# EAGLE design piezo (EAGLE 9.2.2)
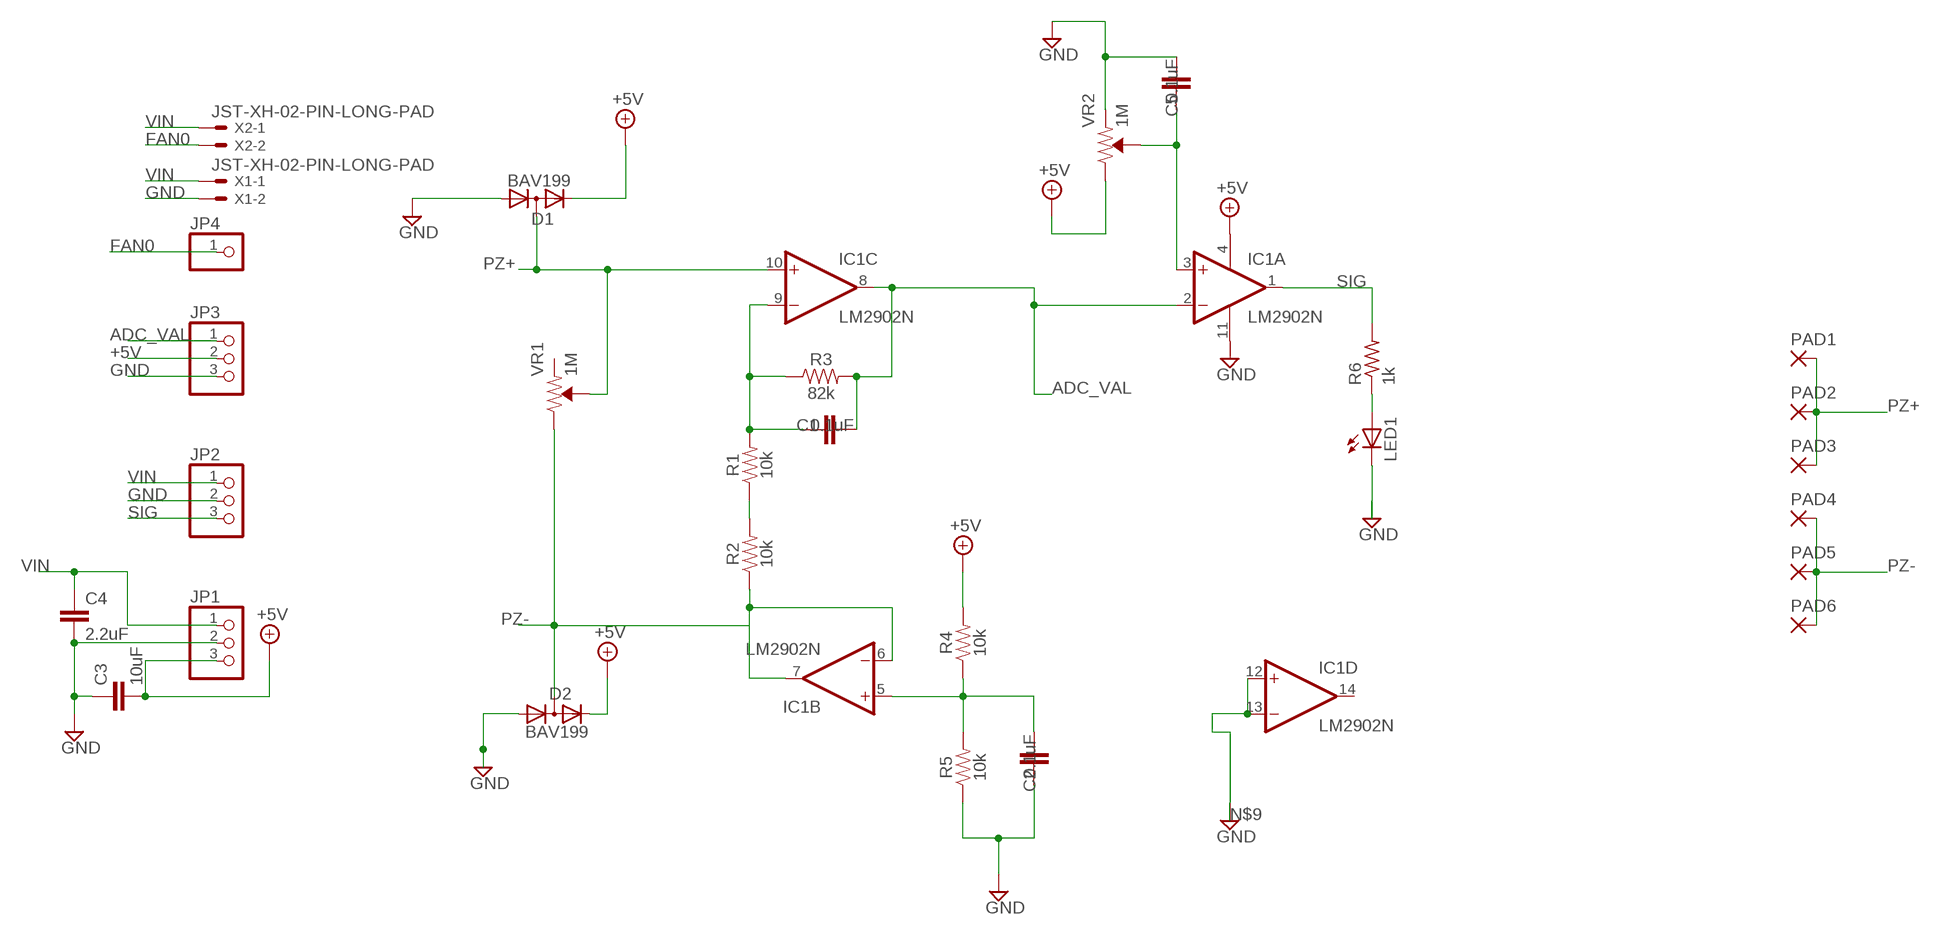
[diagram p0: schematic, sheet 1]

## Parts
C1  0.1uF  C-EU025-024X044  [C025-024X044]
C2  0.1uF  C-EU025-024X044  [C025-024X044]
C3  10uF  C2,5-3  [C2.5-3]
C4  2.2uF  C2,5-3  [C2.5-3]
C5  0.1uF  C-EU025-024X044  [C025-024X044]
D1  BAV199  [SOT23]
D2  BAV199  [SOT23]
IC1  LM2902N  [DIL14]
JP1  PINHD-1X3  [1X03]
JP2  PINHD-1X3  [1X03]
JP3  PINHD-1X3  [1X03]
JP4  PINHD-1X1  [1X01]
LED1  LED5MM  [LED5MM]
PAD1  1,6/0,8  [1,6/0,8]
PAD2  1,6/0,8  [1,6/0,8]
PAD3  1,6/0,8  [1,6/0,8]
PAD4  1,6/0,8  [1,6/0,8]
PAD5  1,6/0,8  [1,6/0,8]
PAD6  1,6/0,8  [1,6/0,8]
R1  10k  10KOHM-HORIZ-1/4W-1%  [AXIAL-0.3]
R2  10k  10KOHM-HORIZ-1/4W-1%  [AXIAL-0.3]
R3  82k  100KOHM-HORIZ-1/4W-1%  [AXIAL-0.3]
R4  10k  10KOHM-HORIZ-1/4W-1%  [AXIAL-0.3]
R5  10k  10KOHM-HORIZ-1/4W-1%  [AXIAL-0.3]
R6  1k  R-US_0207/9  [0207/9]
VR1  1M  TRIMPOT-SMD-3MM-OPEN-1/10W-25%  [TRIMPOT-SMD-TC33X]
VR2  1M  TRIMPOT-SMD-3MM-OPEN-1/10W-25%  [TRIMPOT-SMD-TC33X]
X1  JST-XH-02-PIN-LONG-PAD  [JST-XH-02-PACKAGE-LONG-PAD]
X2  JST-XH-02-PIN-LONG-PAD  [JST-XH-02-PACKAGE-LONG-PAD]

## Nets
+5V: C3.2 D1.2(C) D2.2(C) IC1.4(P:V+) JP1.3 JP3.2 R4.P$2 VR2.1(CW)
ADC_VAL: C1.2 IC1.2(A:-IN) IC1.8(C:OUT) JP3.1 R3.P$2
FAN0: JP4.1 X2.2
GND: C2.1 C3.1 C4.2 D1.1(A) D2.1(A) IC1.11(P:V-) JP1.2 JP2.2 JP3.3 LED1.K(C) R5.P$1 X1.2
N$1: R1.P$1 R2.P$2
N$2: C1.1 IC1.9(C:-IN) R1.P$2 R3.P$1
N$4: LED1.A R6.1
N$5: C2.2 IC1.5(B:+IN) R4.P$1 R5.P$2
N$7: C5.1 IC1.3(A:+IN) VR2.2(WIPER)
N$8: C5.2 VR2.3(CCW) ; supply symbol labelled GND
N$9: IC1.12(D:+IN) IC1.13(D:-IN) ; supply symbol labelled GND
PZ+: D1.3(AC) IC1.10(C:+IN) PAD1.1(P) PAD2.1(P) PAD3.1(P) VR1.2(WIPER)
PZ-: D2.3(AC) IC1.6(B:-IN) IC1.7(B:OUT) PAD4.1(P) PAD5.1(P) PAD6.1(P) R2.P$1 VR1.1(CW)
SIG: IC1.1(A:OUT) JP2.3 R6.2
VIN: C4.1 JP1.1 JP2.1 X1.1 X2.1
Unconnected: IC1.14(D:OUT) VR1.3(CCW)

## Library data of the parts
C1 C2 C5 = rcl:C-EU: CAPACITOR, European symbol; SPICEPREFIX: C
C3 C4 = capacitor-wima:C: CAPACITOR naming: grid - package width
D1 D2 = diode:BAV199: DIODE low-leakage double diode
IC1 = linear:LM2902: Low power quad operational amplifier Source: Data sgeet <http://www.st.com/internet/com/TECHNICAL_RESOURCES/TECHNICAL_LITERATURE/DATASHEET/CD00000533.pdf>
JP1-JP3 = adafruit:PINHD-1X3: PIN HEADER
JP4 = adafruit:PINHD-1X1: Pin header 1x1 for 0.1" spacing With round pins
LED1 = adafruit:LED: LED OSRAM: - CHIPLED LG R971, LG N971, LY N971, LG Q971, LY Q971, LO R971, LY R971 LH N974, LH R974 LS Q976, LO Q976, LY Q976 LO Q996 - Hyper CHIPLED LW Q18S LB Q993, LB Q99A, LB R99A - SideLED LS A670, LO A670, LY A670, LG A670, LP A670 LB A673, LV A673, LT A673, LW A673 LH A674 LY A675 LS A676, LA A676, LO A676, LY A676, LW A676 LS A679, LY A679, LG A679 - Hyper Micro SIDELED® LS Y876, LA Y876, LO Y876, LY Y876 LT Y87S - SmartLED LW L88C, LW L88S LB L89C, LB L89S, LG L890 LS L89K, LO L89K, LY L89K LS L896, LA L896, LO L896, LY L896 - TOPLED LS T670, LO T670, LY T670, LG T670, LP T670 LSG T670, LSP T670, LSY T670, LOP T670, LYG T670 LG T671, LOG T671, LSG T671 LB T673, LV T673, LT T673, LW T673 LH T674 LS T676, LA T676, LO T676, LY T676, LB T676, LH T676, LSB T676, LW T676 LB T67C, LV T67C, LT T67C, LS T67K, LO T67K, LY T67K, LW E67C LS E67B, LA E67B, LO E67B, LY E67B, LB E67C, LV E67C, LT E67C LW T67C LS T679, LY T679, LG T679 LS T770, LO T770, LY T770, LG T770, LP T770 LB T773, LV T773, LT T773, LW T773 LH T774 LS E675, LA E675, LY E675, LS T675 LS T776, LA T776, LO T776, LY T776, LB T776 LHGB T686 LT T68C, LB T68C - Hyper Mini TOPLED® LB M676 - Mini TOPLED Santana® LG M470 LS M47K, LO M47K, LY M47K Source: http://www.osram.convergy.de/
PAD1-PAD6 = wirepad:1,6/0,8: THROUGH-HOLE PAD
R1 R2 R4 R5 = SparkFun-Resistors:10KOHM: 10kΩ resistor A resistor is a passive two-terminal electrical component that implements electrical resistance as a circuit element. Resistors act to reduce current flow, and, at the same time, act to lower voltage levels within circuits. - Wikipedia; PROD_ID: RES-12183
R3 = SparkFun-Resistors:100KOHM: 100kΩ resistor A resistor is a passive two-terminal electrical component that implements electrical resistance as a circuit element. Resistors act to reduce current flow, and, at the same time, act to lower voltage levels within circuits. - Wikipedia; PROD_ID: RES-12184; VALUE: 100k
R6 = adafruit:R-US_: RESISTOR, American symbol
VR1 VR2 = SparkFun-Resistors:TRIMPOT: Trimming Potentiometer (Trimpot) Three-terminal potentiometers, with an adjustable wiper and two adjustable resistors. A pot can be used to create a configurable voltage divider, or as a variable resistor. "Trimpots" are a subset of potentiometers, usually intended for "set-and-forget" applications. They're often more delicate than standard potentiometers - rated for fewer turns. Variants PTH-KNOB - PTH Trimpot w/ finger-adjustable knob Trimpot 10K with Knob <https://www.sparkfun.com/products/9806> (COM-09806) Datasheet <http://www.sparkfun.com/datasheets/Components/General/TSR-3386.pdf> SMD-3MM-CLOSED-FRAME - SMD 3mm Square Closed-Frame Trimpot Used on e.g. EasyDriver - Stepper Motor Driver <https://www.sparkfun.com/products/12779> Datasheet <http://www.bitechnologies.com/pdfs/22.pdf> (22AR10KTR) SMD-5MM - SMD 5mm Square Closed-Frame Trimpot Used on e.g. IOIO-OTG - V2.2 <https://www.sparkfun.com/products/13613> Datasheet <http://www.vishay.com/docs/51008/ts53.pdf> (TS53YL502MR10) SMD-3MM-1/10W-25% - 3mm Square Open-Frame Trimpot Used on e.g. SparkFun Shapeoko <https://www.sparkfun.com/products/13899> Datasheet <http://www.bourns.com/docs/Product-Datasheets/TC33.pdf> (TC33X-2-103E); PROD_ID: RES-12428; VALUE: 10k
X1 X2 = Rembrandt Electronics - JST XH Connectors v1-0:JST-XH-02-PIN: JST XH Connector 2 Pin Wire to board connector. Pitch: 2,54 mm, (0.100") Number of pins: 2 Created by Rembrandt Electronics www.rembrandtelectronics.com

## Board
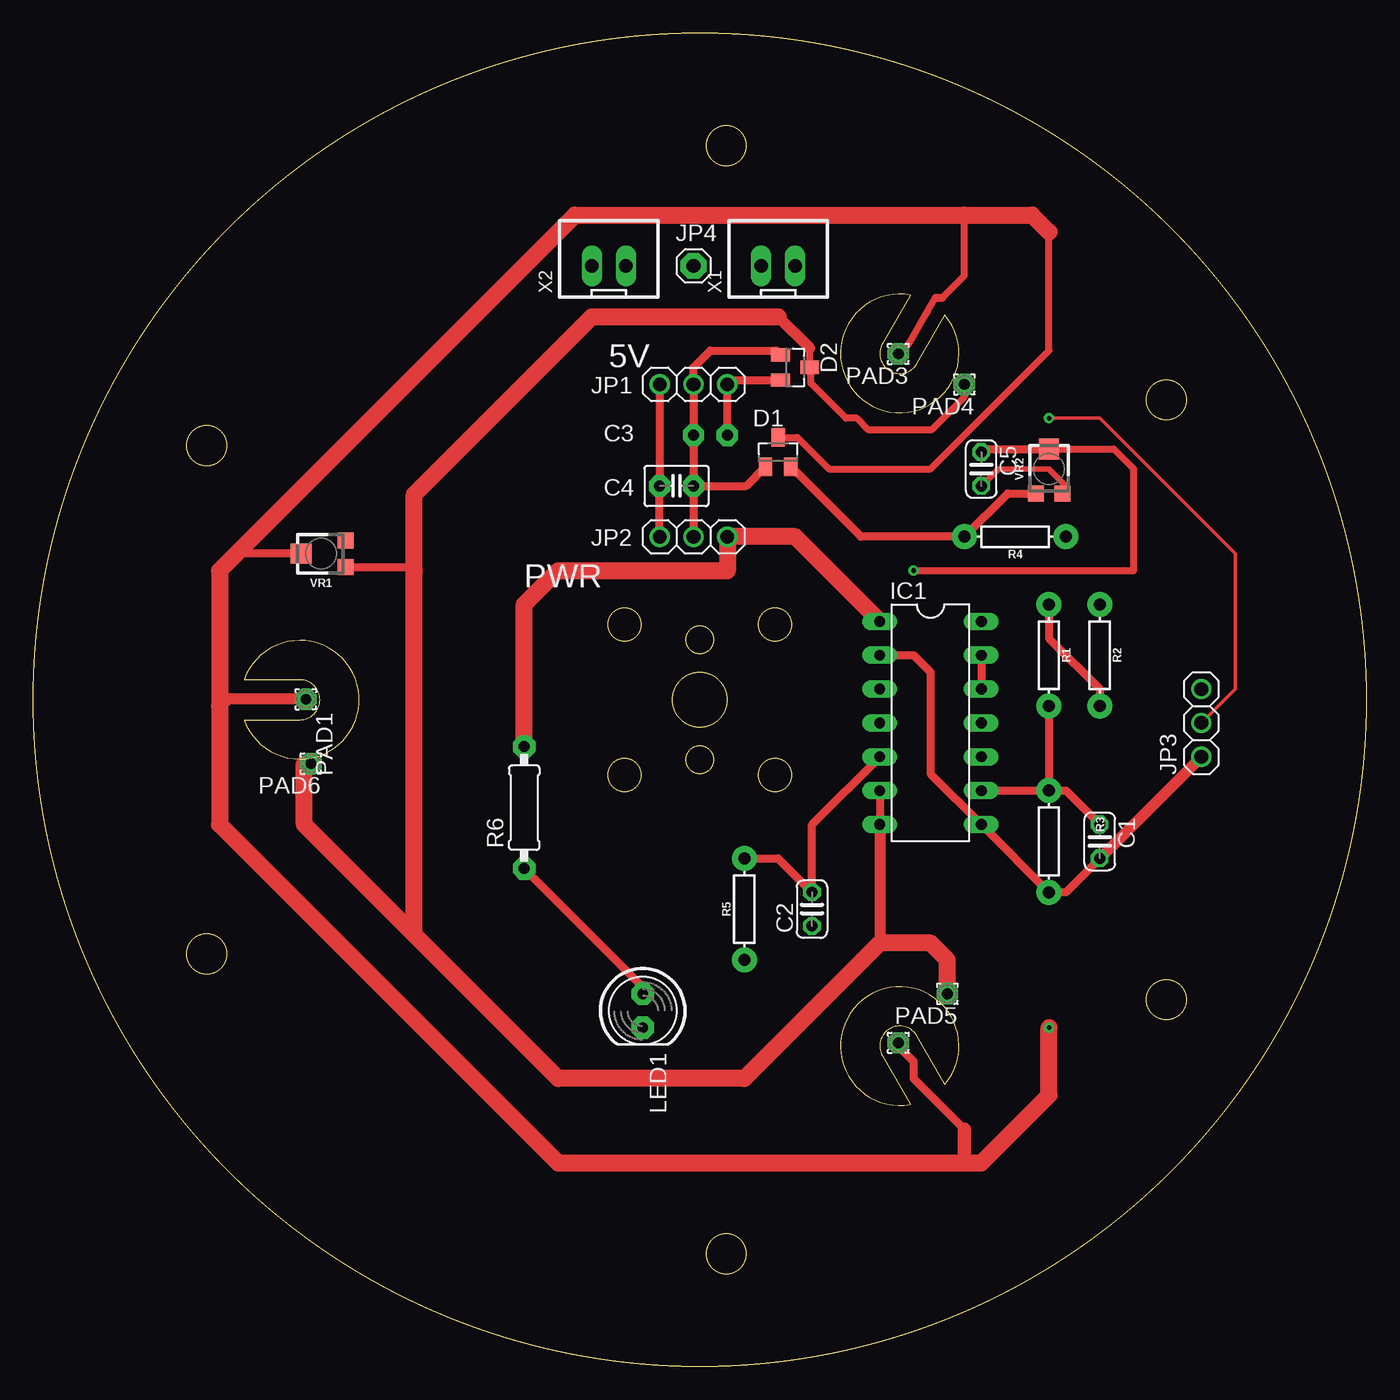
[diagram p1: board, top side]
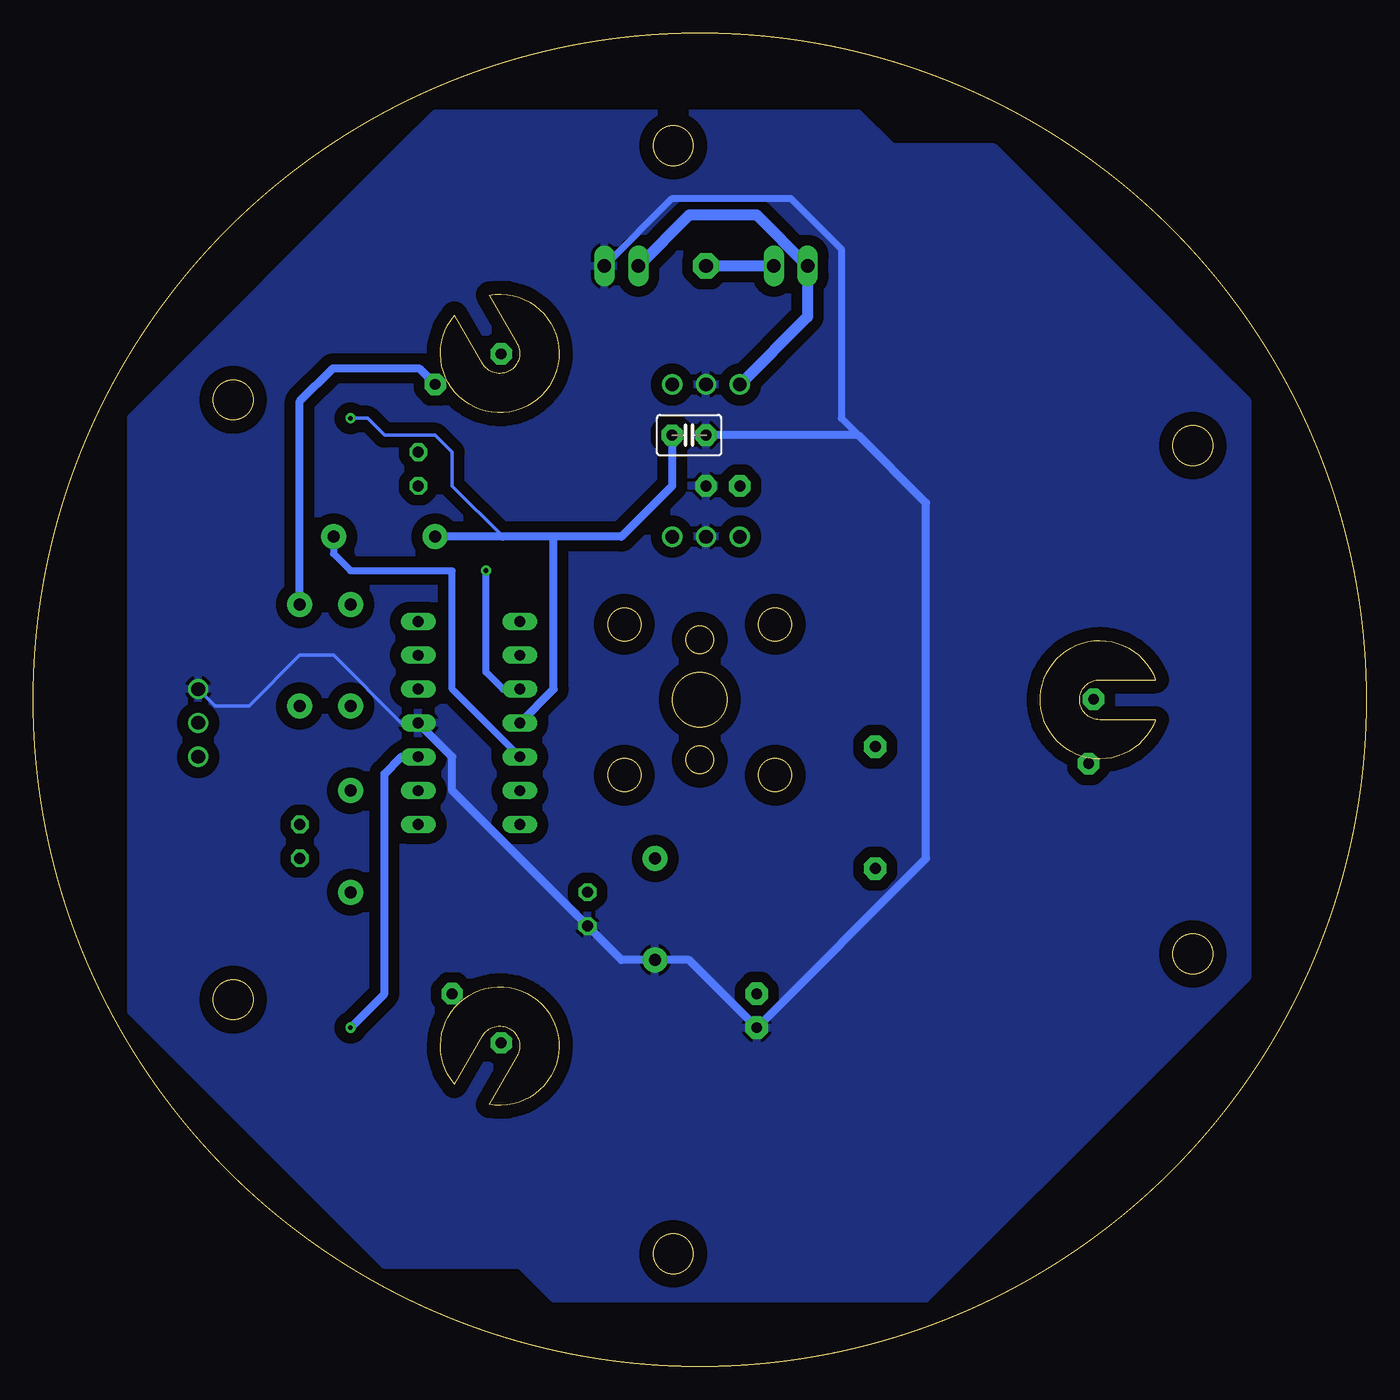
[diagram p2: board, bottom side, seen from below]

Size 100 x 100 mm. Coordinates in mm from the lower left corner, seen from the top.
Outline: 66.3,75.23 68.39,78.86 arc-321 65.8,80.36 63.7,76.73 arc180 66.3,75.23
Outline: 63.7,23.27 65.8,19.64 arc-321 68.39,21.14 66.3,24.77 arc180 63.7,23.27
Outline: 20,51.5 15.81,51.5 arc-321 15.81,48.5 20,48.5 arc180 20,51.5
Outline: circle at 50,50 radius 50
Outline: circle at 50,50 radius 50
Outline: circle at 50,45.5 radius 1.05
Outline: circle at 44.34,44.34 radius 1.25
Outline: circle at 50,54.5 radius 1.05
Outline: circle at 55.66,44.34 radius 1.25
Outline: circle at 55.66,55.66 radius 1.25
Outline: circle at 44.34,55.66 radius 1.25
Outline: circle at 50,50 radius 2.05
Outline: circle at 85,72.5 radius 1.5
Outline: circle at 13.01,30.94 radius 1.5
Outline: circle at 85,27.5 radius 1.5
Outline: circle at 13.01,69.06 radius 1.5
Outline: circle at 51.99,91.56 radius 1.5
Outline: circle at 51.99,8.44 radius 1.5
Copper layers (1*16): Top 0.035mm / dielectric 1.5mm / Bottom 0.035mm
Design rules "default": minimum track width 6mil, minimum drill 0.35mm, track to track 6mil, track to pad 6mil, pad to pad 6mil, via to via 6mil, smd to smd 6mil, copper to edge 40mil, drill to drill 6mil, minimum pad ring 10mil, minimum via ring 8mil, stop-mask expansion 4mil, vias tented up to drill 0mil, thermal gap 10mil

### Footprints (pad centres in the part's own frame; a part is rotated, then mirrored left to right if it is on the bottom)
C025-024X044 = drill 0.813 octagon: 1 -1.27,0; 2 1.27,0
C2.5-3 = drill 0.813 pad 1.6 octagon: 1 -1.27,0; 2 1.27,0
SOT23 = smd 1 x 1.4: 1 -0.95,-1.1; 2 0.95,-1.1; 3 0,1.1
DIL14 = drill 0.813 long: 1 -7.62,-3.81; 2 -5.08,-3.81; 3 -2.54,-3.81; 4 0,-3.81; 5 2.54,-3.81; 6 5.08,-3.81; 7 7.62,-3.81; 8 7.62,3.81; 9 5.08,3.81; 10 2.54,3.81; 11 0,3.81; 12 -2.54,3.81; 13 -5.08,3.81; 14 -7.62,3.81
1X03 = drill 1.016: 1 -2.54,0; 2 0,0; 3 2.54,0
1X01 = drill 1.016 pad 1.93 octagon: 1 0,0
LED5MM = drill 0.813 pad 1.676 octagon: A -1.27,0; K 1.27,0
1,6/0,8 = drill 0.813 pad 1.6 octagon: 1 0,0
AXIAL-0.3 = drill 0.9 pad 1.88: P$1 -3.81,0; P$2 3.81,0
0207/9 = drill 0.813 pad 1.676 octagon: 1 -4.572,0; 2 4.572,0
TRIMPOT-SMD-TC33X = smd 1.2 x 1.2: 1 -1,-1.825; 3 1,-1.825 | smd 1.5 x 1.6: 2 0,1.5
JST-XH-02-PACKAGE-LONG-PAD = drill 1.016 long: 1 -1.27,0; 2 1.27,0

### Placement (x,y rotation side)
C1  80.01,39.37 270 top
C2  58.42,34.29 90 top
C3  50.8,69.85 180 bottom
C4  48.26,66.04 0 top
C5  71.12,67.31 270 top
D1  55.88,68.58 0 top
D2  57.15,74.93 270 top
IC1  67.31,48.26 270 top
JP1  49.53,73.66 0 top
JP2  49.53,62.23 0 top
JP3  87.63,48.26 90 top
JP4  49.53,82.55 0 top
LED1  45.72,26.67 270 top
PAD1  20.45,50.04 180 top
PAD2  64.9,24.26 180 top
PAD3  64.9,75.95 180 top
PAD4  69.85,73.66 180 top
PAD5  68.58,27.94 180 top
PAD6  20.83,45.21 180 top
R1  76.2,53.34 270 top
R2  80.01,53.34 270 top
R3  76.2,39.37 270 top
R4  73.66,62.23 180 top
R5  53.34,34.29 90 top
R6  36.83,41.91 90 top
VR1  21.59,60.96 90 top
VR2  76.2,67.31 0 top
X1  55.88,82.55 0 top
X2  43.18,82.55 0 top

### Tracks (layer width: path | path; a pad name or v marks a point on that pad's centre or on a via)
+5V  (via drill 0.35)
  Top 0.254: v76.2,71.12 80.01,71.12 90.17,60.96 90.17,50.8 JP3.2
  Top 0.61: C3.2 JP1.3 52.39,73.98 D2.2 | D1.2 62.08,62.23 R4.P$2 73.11,65.48 VR2.1
  Bottom 0.254: 64.77,62.23 68.58,66.04 68.58,68.58 69.85,69.85 73.66,69.85 74.93,71.12 v76.2,71.12
  Bottom 0.61: IC1.4 60.96,50.8 60.96,62.23 | 60.96,62.23 64.77,62.23 R4.P$2 | C3.2 52.07,66.04 55.88,62.23 60.96,62.23
ADC_VAL
  Top 0.61: C1.2 77.47,35.56 R3.P$2 IC1.8 67.31,44.45 67.31,52.07 66.04,53.34 IC1.2
  Top 0.813: C1.2 JP3.1
FAN0
  Bottom 0.813: X2.2 JP4.1
GND
  Top 0.61: C4.2 C3.1 JP1.2 49.53,74.93 50.8,76.2 55.73,76.2 D2.1 | C4.2 JP2.2 | D1.1 53.49,66.04 C4.2
  Bottom 0.254: JP3.3 86.36,49.53 83.82,49.53 80.01,53.34 77.47,53.34 72.39,48.26 IC1.11
  Bottom 0.508: X1.2 52.07,87.63 43.18,87.63 39.37,83.82 39.37,71.12 38.1,69.85
  Bottom 0.61: C3.1 38.1,69.85 33.02,64.77 33.02,38.1 LED1.K 50.8,30.48 R5.P$1 55.88,30.48 C2.1 68.58,43.18 68.58,45.72 IC1.11
  pour Bottom (isolate 0.813): 17.78,81.28 27.94,91.44 35.56,91.44 38.1,93.98 48.26,93.98 69.85,93.98 72.39,91.44 92.71,71.12 92.71,58.42 92.71,26.67 73.66,7.62 63.5,7.62 60.96,5.08 48.26,5.08 33.02,5.08 16.51,21.59 8.89,29.21 8.89,36.83 8.89,72.39 11.43,74.93 17.78,81.28
N$1
  Top 0.61: R1.P$1 76.2,54.61 80.01,50.8 R2.P$2
N$2
  Top 0.61: R3.P$1 77.47,43.18 C1.1 | IC1.9 R3.P$1 | R1.P$2 R3.P$1
N$4
  Top 0.61: R6.1 45.72,28.45 LED1.A
N$5
  Top 0.61: R5.P$2 55.88,38.1 C2.2 58.42,40.64 IC1.5
  Bottom 0.508: IC1.5 68.58,50.8 68.58,59.69 76.2,59.69 77.47,60.96 R4.P$1
N$7  (via drill 0.35)
  Top 0.508: VR2.2 81.05,68.81 82.55,67.31 82.55,59.69 v66.04,59.69
  Top 0.61: C5.1 71.35,68.81 VR2.2
  Bottom 0.508: IC1.3 64.77,50.8 66.04,52.07 v66.04,59.69
N$8
  Top 0.406: C5.2 72.39,67.31 76.2,67.31 77.47,66.04 77.47,65.75 VR2.3
N$9
  Top 0.61: IC1.13 IC1.12
PZ+  (via drill 0.35)
  Top 0.152: PAD1.1 20.17,49.76
  Top 0.508: 76.2,85.09 76.2,76.2 67.31,67.31 59.69,67.31 57.32,69.68 D1.3 | PAD3.1 65.72,76.77 66.97,78.94 | 66.97,78.94 67.68,80.17 | 69.85,86.36 69.85,81.81 68.2,80.17 | 66.97,78.94 67.15,79.25
  Top 0.61: 55.88,69.85 D1.3 | VR1.2 15.24,60.96 | 64.9,24.13 PAD2.1 64.9,24 66.04,22.86 66.04,21.59 69.85,17.78 | 67.68,80.17 68.2,80.17
  Top 0.813: PAD1.1 14.48,50.04
  Top 1.016: 14.48,50.04 13.97,49.53 | 69.85,17.78 69.85,15.24
  Top 1.27: 76.2,85.09 74.93,86.36 69.85,86.36 40.64,86.36 15.24,60.96 13.97,59.69 13.97,49.53 13.97,40.64 39.37,15.24 69.85,15.24 71.12,15.24 76.2,20.32 v76.2,25.4
  Bottom 0.61: v76.2,25.4 73.66,27.94 73.66,44.45 72.39,45.72 IC1.10
PZ-
  Top 0.508: PAD4.1 69.85,72.72 67.37,70.24 62.67,70.24 61.79,71.12 60.96,71.12 58.34,73.75 58.34,75.02 | D2.3 58.25,76.37
  Top 0.61: D2.3 58.34,75.02 58.37,75.05 | VR1.1 28.3,59.96 28.57,59.69 | IC1.6 IC1.7 | PAD6.1 20.32,45.21
  Top 0.813: IC1.7 63.5,31.75 | 58.25,76.37 55.88,78.74
  Top 1.27: PAD5.1 68.58,30.48 67.31,31.75 63.5,31.75 53.34,21.59 39.37,21.59 28.57,32.38 | 28.57,32.38 20.32,40.64 20.32,45.21 | 55.88,78.74 41.91,78.74 28.57,65.41 28.57,59.69 28.57,32.38
  Bottom 0.61: R2.P$1 80.01,72.39 77.52,74.88 71.07,74.88 PAD4.1
SIG
  Top 1.27: R6.2 36.83,57.15 39.37,59.69 52.07,59.69 JP2.3 57.15,62.23 IC1.1
VIN
  Top 0.61: JP2.1 C4.1 JP1.1
  Bottom 0.813: JP1.1 41.91,78.74 X2.1 45.72,86.36 50.8,86.36 X1.1

### Text on the board
tNames: 5V | PWR